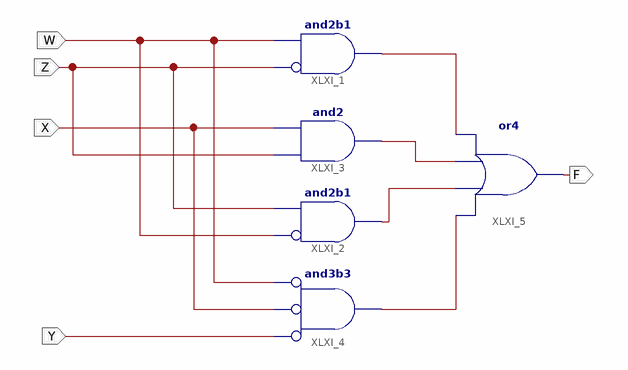
[diagram p0: schematic sheet 1]
// Xilinx ISE schematic fk_1.sch (artix7) as structural Verilog: 5 symbols, 5 ports
module fk_1 (
  input  W,
  input  Z,
  input  X,
  input  Y,
  output F
);

  wire XLXN_1, XLXN_2, XLXN_4, XLXN_5;

  and XLXI_1 (XLXN_1, ~Z, W);  // and2b1
  and XLXI_2 (XLXN_4, ~W, Z);  // and2b1
  and XLXI_3 (XLXN_2, Z, X);
  and XLXI_4 (XLXN_5, ~Y, ~X, ~W);  // and3b3
  or XLXI_5 (F, XLXN_5, XLXN_4, XLXN_2, XLXN_1);
endmodule
